# Altium schematic sheet Sheet1.SchDoc
size A
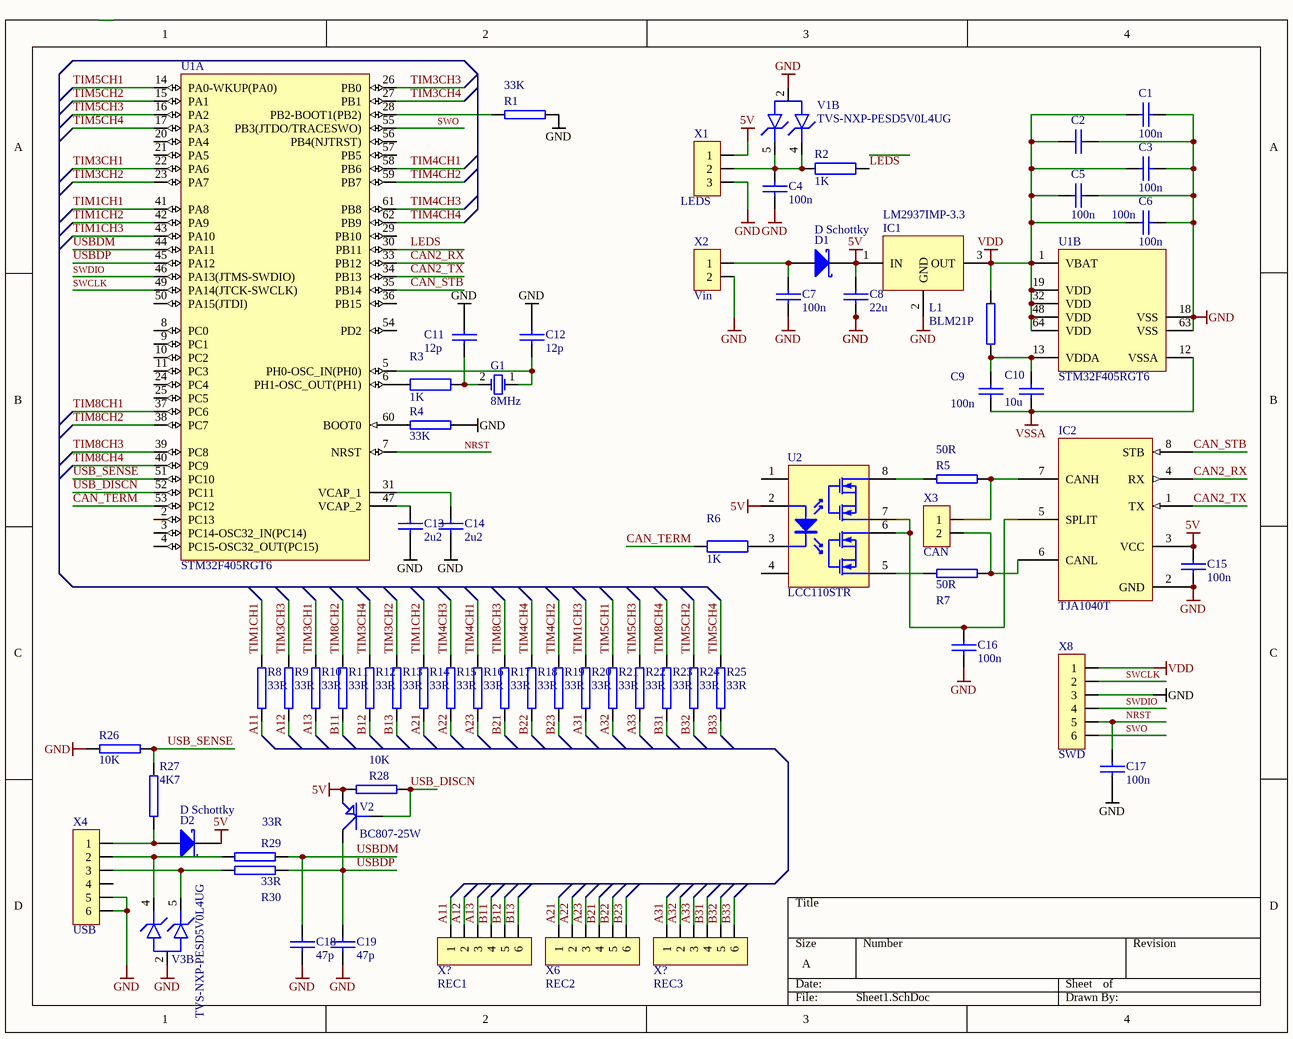
[diagram p0: Sheet1.SchDoc]

## Parts
(Parts that share a designator on the sheet are numbered #1, #2 ... from top to bottom, then left to right.)
C1  100n  [0805-C-IPC-V]
C2  100n  [0805-C-IPC-V]
C3  100n  [0805-C-IPC-V]
C4  100n  [0805-C-IPC-V]
C5  100n  [0805-C-IPC-V]
C6  100n  [0805-C-IPC-V]
C7  100n  [0805-C-IPC-V]
C8  22u  [CAPC3225N]
C9  100n  [0805-C-IPC-V]
C10  10u  [0805-C-IPC-V]
C11  12p  [0805-C-IPC-V]
C12  12p  [0805-C-IPC-V]
C13  2u2  [0805-C-IPC-V]
C14  2u2  [0805-C-IPC-V]
C15  100n  [0805-C-IPC-V]
C16  100n  [0805-C-IPC-V]
C17  100n  [0805-C-IPC-V]
C18  47p  [0805-C-V]
C19  47p  [0805-C-V]
D1  D Schottky  [SMB]
D2  D Schottky  [SMB]
G1  8MHz  [JXG53P2]
IC1  LM2937IMP-3.3  [SOT223-4N-V]
IC2  TJA1040T  [SO_8]
L1  BLM21P  [INDC2012N]
R1  33K  [0805-R-IPC-V]
R2  1K  [0805-R-IPC-V]
R3  1K  [0805-R-IPC-V]
R4  33K  [0805-R-IPC-V]
R5  50R  [0805-R-IPC-V]
R6  1K  [0805-R-IPC-V]
R7  50R  [0805-R-IPC-V]
R8  33R  [0805-R-IPC-V]
R9  33R  [0805-R-IPC-V]
R10  33R  [0805-R-IPC-V]
R11  33R  [0805-R-IPC-V]
R12  33R  [0805-R-IPC-V]
R13  33R  [0805-R-IPC-V]
R14  33R  [0805-R-IPC-V]
R15  33R  [0805-R-IPC-V]
R16  33R  [0805-R-IPC-V]
R17  33R  [0805-R-IPC-V]
R18  33R  [0805-R-IPC-V]
R19  33R  [0805-R-IPC-V]
R20  33R  [0805-R-IPC-V]
R21  33R  [0805-R-IPC-V]
R22  33R  [0805-R-IPC-V]
R23  33R  [0805-R-IPC-V]
R24  33R  [0805-R-IPC-V]
R25  33R  [0805-R-IPC-V]
R26  10K  [0805-R-IPC-V]
R27  4K7  [0805-R-IPC-V]
R28  10K  [0805-R-IPC-V]
R29  33R  [0805-R-IPC-V]
R30  33R  [0805-R-IPC-V]
U1  STM32F405RGT6  [STM-LQFP64_N]  (parts A,B of 2)
U2  LCC110STR  [IXYS-SM-8_V]
V1  TVS-NXP-PESD5V0L4UG  [SC70-5]  (part B of 2)
V2  BC807-25W  [SOT323-3N-CBE]
V3  TVS-NXP-PESD5V0L4UG  [SC70-5]  (part B of 2)
X1  LEDS  [CON-PH_3PIN_JST]
X2  Vin  [CON-PH_2PIN_JST]
X3  CAN  [CON-PH_2PIN_JST]
X4  USB  [CON_uUSB_TOP]
X6  REC2  [CON-06-MALE-TH-2MM-VERTICAL]
X8  SWD  [CON-06-MALE-TH-2MM-VERTICAL]
X?#1  REC1  [CON-06-MALE-TH-2MM-VERTICAL]
X?#2  REC3  [CON-06-MALE-TH-2MM-VERTICAL]

## Nets
5V: C8.2 C15.2 D1.2(K) D2.2(K) IC1.1(IN) IC2.3(VCC) R28.2 U2.2(CTRL+) V2.E X1.1
GND: C1.2 C2.2 C3.2 C4.2 C5.2 C6.2 C7.2 C8.1 C11.2 C12.1 C13.1 C14.1 C15.1 C16.1 C17.1 C18.1 C19.2 IC1.2(GND) IC2.2(GND) R1.1 R4.1 R26.2 U1.18(VSS) U1.63(VSS) V1.2 V3.2 X1.3 X2.2 X4.5 X4.6 X8.3
VDD: C1.1 C2.1 C3.1 C5.1 C6.1 IC1.3(OUT) L1.2 U1.1(VBAT) U1.19(VDD) U1.32(VDD) U1.48(VDD) U1.64(VDD) X8.1
VSSA: C9.2 C10.2 U1.12(VSSA)
A11: R8.1 X?#1.1
A12: R9.1 X?#1.2
A13: R10.1 X?#1.3
A21: R14.1 X6.1
A22: R15.1 X6.2
A23: R16.1 X6.3
A31: R20.1 X?#2.1
A32: R21.1 X?#2.2
A33: R22.1 X?#2.3
B11: R11.1 X?#1.4
B12: R12.1 X?#1.5
B13: R13.1 X?#1.6
B21: R17.1 X6.4
B22: R18.1 X6.5
B23: R19.1 X6.6
B31: R23.1 X?#2.4
B32: R24.1 X?#2.5
B33: R25.1 X?#2.6
CAN2_RX: IC2.4(RX) U1.33(PB12)
CAN2_TX: IC2.1(TX) U1.34(PB13)
CAN_STB: IC2.8(STB) U1.35(PB14)
CAN_TERM: R6.2 U1.53(PC12)
LEDS: R2.1 U1.30(PB11)
NRST: C17.2 U1.7(NRST) X8.5
SWCLK: U1.49(PA14(JTCK-SWCLK)) X8.2
SWDIO: U1.46(PA13(JTMS-SWDIO)) X8.4
SWO: U1.55(PB3(JTDO/TRACESWO)) X8.6
TIM1CH1: R8.2 U1.41(PA8)
TIM1CH2: R14.2 U1.42(PA9)
TIM1CH3: R20.2 U1.43(PA10)
TIM3CH1: R10.2 U1.22(PA6)
TIM3CH2: R13.2 U1.23(PA7)
TIM3CH3: R9.2 U1.26(PB0)
TIM3CH4: R12.2 U1.27(PB1)
TIM4CH1: R16.2 U1.58(PB6)
TIM4CH2: R19.2 U1.59(PB7)
TIM4CH3: R15.2 U1.61(PB8)
TIM4CH4: R18.2 U1.62(PB9)
TIM5CH1: R21.2 U1.14(PA0-WKUP(PA0))
TIM5CH2: R24.2 U1.15(PA1)
TIM5CH3: R22.2 U1.16(PA2)
TIM5CH4: R25.2 U1.17(PA3)
TIM8CH1: U1.37(PC6)
TIM8CH2: R11.2 U1.38(PC7)
TIM8CH3: R17.2 U1.39(PC8)
TIM8CH4: R23.2 U1.40(PC9)
USB_DISCN: R28.1 U1.52(PC11) V2.B
USB_SENSE: R26.1 R27.1 U1.51(PC10)
USBDM: C18.2 R29.2 U1.44(PA11)
USBDP: C19.1 R30.2 U1.45(PA12) V2.C
NetC4_1: C4.1 R2.2 V1.4 V1.5 X1.2
NetC7_1: C7.1 D1.1(A) X2.1
NetC9_1: C9.1 C10.1 L1.1 U1.13(VDDA)
NetC11_1: C11.1 G1.2(OSC2) R3.1
NetC12_2: C12.2 G1.1(OSC1) U1.5(PH0-OSC_IN(PH0))
NetC13_2: C13.2 U1.47(VCAP_2)
NetC14_2: C14.2 U1.31(VCAP_1)
NetC16_2: C16.2 IC2.5(SPLIT) U2.6(NO) U2.7(NC)
NetD2_1: D2.1(A) R27.2 X4.1
NetIC2_6: IC2.6(CANL) R7.1 X3.2
NetIC2_7: IC2.7(CANH) R5.1 X3.1
NetR1_2: R1.2 U1.28(PB2-BOOT1(PB2))
NetR3_2: R3.2 U1.6(PH1-OSC_OUT(PH1))
NetR4_2: R4.2 U1.60(BOOT0)
NetR5_2: R5.2 U2.8(NC)
NetR6_1: R6.1 U2.3(CTRL-)
NetR7_2: R7.2 U2.5(NO)
NetR29_1: R29.1 V3.4 X4.2
NetR30_1: R30.1 V3.5 X4.3

Not connected (* = marked no-connect by the designer): U1 2(PC13) 3(PC14-OSC32_IN(PC14)) 4(PC15-OSC32_OUT(PC15)) 8(PC0) 9(PC1) 10(PC2) 11(PC3) 20(PA4) 21(PA5) 24(PC4) 25(PC5) 29(PB10) 36(PB15) 50(PA15(JTDI)) 54(PD2) 56(PB4(NJTRST)) 57(PB5); U2 1(DNU) 4(DNU); X4 4

## Library data of the parts
C1-C7 C9 C15 C16 = C: KOND. 0805 100nF 50V 10% X7R; 3. Dodatni opis: SMD 0805 X7R 10% 100V; 9.a FOTONA ID:: 59327; Mi Elektronika ID: 006076; 1. Naziv: KOND.; 8. Oblika: SMD 0805; 2. Vrednost: 100n
C8 = 22u 1210 X7R 25V 10%: KOND. 1210 22uF 25V 10% X5R; 4. Proizvajalec: MURATA; 6. Dobavitelj: Farnell; 7. Dobavitelj koda: 1828821; 5. Proizvajalec koda: GRM32ER61E226KE15L; 3. Dodatni opis: SMD 1210 X5R 10% 25V; 1. Naziv: KOND.; 8. Oblika: SMD 1210; 2. Vrednost: 22u
C10 = 10u 0603 X5R 6V3 10%: KOND. 0805 10uF 10V 10% X7R; 4. Proizvajalec: TDK; 6. Dobavitelj: Farnell; 7. Dobavitelj koda: 2346934; 5. Proizvajalec koda: C2012X7R1A106K125AC; 3. Dodatni opis: SMD 0805 X7R 10% 10V; 9.a FOTONA ID:: 76490; 1. Naziv: KOND.; 8. Oblika: SMD 0805; 2. Vrednost: 10u
C11 C12 = 12p 0603 C0G 50V 10%: KOND. 0805 12pF 50V 5% COG; 3. Dodatni opis: SMD 0805 COG 5% 50V; 1. Naziv: KOND.; 8. Oblika: SMD 0805; 2. Vrednost: 12p
C13 C14 = 2u2 0603 X5R 16V 10%: KOND. 0805 2,2uF 25V 10% X7R; 4. Proizvajalec: MURATA; 6. Dobavitelj: Farnell; 7. Dobavitelj koda: 2688538; 5. Proizvajalec koda: GRM21BR71E225KE11L; 3. Dodatni opis: SMD 0805 X7R 10% 25V; 1. Naziv: KOND.; 8. Oblika: SMD 0805; 2. Vrednost: 2u2
C17 = 100n 0603 X7R 50V 10%: KOND. 0805 100nF 50V 10% X7R; 3. Dodatni opis: SMD 0805 X7R 10% 100V; 9.a FOTONA ID:: 59327; Mi Elektronika ID: 006076; 1. Naziv: KOND.; 8. Oblika: SMD 0805; 2. Vrednost: 100n
C18 C19 = C: KOND. 0805 47pF 50V 5% COG; 3. Dodatni opis: SMD 0805 COG 5% 50V; 9.a FOTONA ID:: 39615; 1. Naziv: KOND.; 8. Oblika: SMD 0805; 2. Vrednost: 47p
D1 D2 = D Schottky: Schottky Diode; Published: 8-Jun-2000; LatestRevisionDate: 17-Jul-2002; LatestRevisionNote: Re-released for DXP Platform.; PackageReference: SMB; Publisher: Altium Limited; PackageDescription: DO-214-AA/SMB; 2 C-Bend Leads; Body 5.3 x 3.6 mm, inc. leads (LxW); Code_JEDEC: DO-214-AA
G1 = Crystal 25MHz: Crystal, 8 MHz, SMD, 5mm x 3.2mm; 8. Oblika: SMD 5x3.2mm; 6. Dobavitelj: Farnell; 7. Dobavitelj koda: 2101329RL; 1. Naziv: KRISTAL; 4. Proizvajalec: ABRACON; 5. Proizvajalec koda: ABM3-8.000MHZ-D2Y-T; 2. Vrednost: 8MHz
IC1 = LM2937IMP-3.3: Fixed 3V3 Regulator; 1. Naziv: VEZJE INT.; 8. Oblika: SMD SOT-232-3N; 4. Proizvajalec: TEXAS INSTRUMENTS; 6. Dobavitelj: Farnell; 7. Dobavitelj koda: 2296021; 5. Proizvajalec koda: LM2937IMP-3.3/NOPB; 9.a FOTONA ID:: 87573; 2. Vrednost: LM2937IMP-3.3
IC2 = TJA1040: CAN Bus, Transceiver; 1. Naziv: VEZJE INT.; 8. Oblika: SMD SO-8; 4. Proizvajalec: NXP; 6. Dobavitelj: Farnell; 7. Dobavitelj koda: 2400545; 5. Proizvajalec koda: TJA1040T/CM,118; 9.a FOTONA ID:: 80870; 2. Vrednost: TJA1040T
L1 = BLM21: Ferrite Bead, 0805; 1. Naziv: DUŠILKA; 4. Proizvajalec: MURATA; 6. Dobavitelj: Farnell; 7. Dobavitelj koda: 1515663; 5. Proizvajalec koda: BLM21PG331SN1D; 9.a FOTONA ID:: 90218; 8. Oblika: SMD 0805; 2. Vrednost: BLM21PG331SN1D
R1 R4 = R: UPOR 0805 33K 1% 0,125W; 3. Dodatni opis: SMD 0805 1% 150V; 9.a FOTONA ID:: 57352; Mi Elektronika ID: 002109; 1. Naziv: UPOR; 8. Oblika: SMD 0805; 2. Vrednost: 33K
R2 R3 R6 = 1k 1% 0603 0.1W 50V: UPOR 0805 1K 1% 0,125W; 3. Dodatni opis: SMD 0805 1% 150V; 9.a FOTONA ID:: 57346; 1. Naziv: UPOR; 8. Oblika: SMD 0805; 2. Vrednost: 1K
R5 R7 = R: UPOR 0805 62R 1% 0,125W; 3. Dodatni opis: SMD 0805 1% 150V; 1. Naziv: UPOR; 8. Oblika: SMD 0805; 2. Vrednost: 50R
R8-R25 R29 R30 = R: UPOR 0805 33R 1% 0,125W; 3. Dodatni opis: SMD 0805 1% 150V; Mi Elektronika ID: 002153; 1. Naziv: UPOR; 8. Oblika: SMD 0805; 2. Vrednost: 33R
R26 R28 = R: UPOR 0805 10K 1% 0,125W; 3. Dodatni opis: SMD 0805 1% 150V; 9.a FOTONA ID:: 57338; Mi Elektronika ID: 002470; 1. Naziv: UPOR; 8. Oblika: SMD 0805; 2. Vrednost: 10K
R27 = R: UPOR 0805 4,7K 1% 0,125W; 3. Dodatni opis: SMD 0805 1% 150V; 9.a FOTONA ID:: 57341; 1. Naziv: UPOR; 8. Oblika: SMD 0805; 2. Vrednost: 4K7
U1 = STM32F405RGT6: ARM Cortex-M4 32-bit MCU+FPU, 210 DMIPS, 1024 kB Flash, 192 kB Internal RAM, 51 I/Os, 64-pin LQFP, -40 to 85 degC, Tray; Manufacturer: STMicroelectronics; D/A Converter: 2x12-bit; FLASH Size (Prog) (kB): 1024; I/Os (High Current): 51; Internal RAM Size (kB): 192; Operating Frequency(F) (Processor speed) (MHz): 168; Supply Voltage(Vcc) max (V): 3.6; Supply Voltage(Vcc) min (V): 1.8; DatasheetVersion: Rev. 4; PackageVersion: Rev. 4, 06/2013; PackageReference: LQFP64; PackageDescription: 64-Pin Low Profile Quad Flat Package, 10 x 10 mm Body, 0.5 mm Pitch; Supplier 1: Digi-Key; Supplier Part Number 1: 497-11767-ND; Supplier 2: Farnell; Supplier Part Number 2: 2064363; Supplier 3: Newark; Supplier Part Number 3: 73T2329; Supplier 4: Mouser; Supplier Part Number 4: 511-STM32F405RGT6; Core: ARM Cortex-M4; Packing: Tray; Mounting Technology: Surface Mount; PartNumber: STM32F405RGT6; ComponentLink1Description: Manufacturer URL; ComponentLink1URL: http://www.st.com/web/en/home.html; ComponentLink2Description: Datasheet; ComponentLink2URL: http://www.st.com/st-web-ui/static/active/en/resource/technical/document/datasheet/DM00037051.pdf; ComponentLink3Description: Package Specification; ComponentLink3URL: http://www.st.com/st-web-ui/static/active/en/resource/technical/document/datasheet/DM00037051.pdf
U2 = CMP-2000-06537-1: 1-Form-C OptoMOS(R) Relay / , 350 V, 120 mA, 35 Ohm, -40 to 85 degC, 8-Pin SMD, RoHS, Tape and Reel; Manufacturer: IXYS; Contact Form: SPDT(1FormC); Load Current Rating: 120mA; Output Type: MOSFET; Input Current: 50mA; Brand: IXYSIntegratedCircuits; Pd - Power Dissipation: 800mW; Input to Output Isolation Method: Optocoupler; Load Voltage Rating: 350VDC; Control Voltage Range: 0.9VDCto1.4VDC; Series: LCC110; Tradename: Clare; Factory Pack Quantity: 1000; Datasheet URL: http://www.ixysic.com/home/pdfs.nsf/www/LCC110.pdf/$file/LCC110.pdf; Mounting Style: SMD/SMT; Package Description: 8-Pin Surface Mount Device, Body 9.652 x 6.35 mm, Pitch 2.54 mm; Product Category: SolidStateRelays-PCBMount; Width: 6.35mm; Mounting Technology: SurfaceMount; Manufacturer URL: http://www.ixys.com/; Package / Case: SMDDIP-8; Datasheet Version: 12/2012; Height: 3.302mm; Type: Isolated; Termination Style: GullWingLead; Length: 9.652mm; Product: TelecommunicationRelays; Package Reference: SM-8; Packaging: Reel
V1 V3 = TVS-NXP-PESD3V3L4UG: TVS, NXP, PESD3V3L4UG, SOT665; 8. Oblika: SMD SC70-5; 6. Dobavitelj: Farnell; 7. Dobavitelj koda: 8737614; 1. Naziv: TVS; 4. Proizvajalec: NXP; 5. Proizvajalec koda: PESD5V0L4UG; 2. Vrednost: TVS-NXP-PESD5V0L4UG; 3. Dodatni opis: PESD5V0L4UG
V2 = BC807W: PNP Bipolar Transistor; 1. Naziv: TRANZISTOR; 8. Oblika: SMD SOT-323-3N; 4. Proizvajalec: NXP; 6. Dobavitelj: Farnell; 7. Dobavitelj koda: 2439008; 5. Proizvajalec koda: BC807-25W,115; 9.a FOTONA ID:: 97206; 2. Vrednost: BC807-25W
X1 = CON3: 1. Naziv: KONEKTOR; 4. Proizvajalec: JST; 6. Dobavitelj: Farnell; 7. Dobavitelj koda: 9492429; 5. Proizvajalec koda: B3B-PH-K-S(LF)(SN); 9.a FOTONA ID:: 90115; 2. Vrednost: LEDS
X2 X3 = JST S2B-ZR-SM4A-TF: Connector, 2 mm, 2 Contacts; 1. Naziv: KONEKTOR; 4. Proizvajalec: JST; 6. Dobavitelj: Farnell; 7. Dobavitelj koda: 9491856; 5. Proizvajalec koda: B2B-PH-K-S(LF)(SN); 9.a FOTONA ID:: 89540
  X2: 2. Vrednost: Vin
  X3: 2. Vrednost: CAN
X4 = Wurth 629 105 136 821: Connector, Micro USB Type B; 1. Naziv: KONEKTOR; 4. Proizvajalec: GCT; 6. Dobavitelj: Farnell; 7. Dobavitelj koda: 2443141; 5. Proizvajalec koda: USB3145-30-1-A; 2. Vrednost: USB
X6 X8 X?#1 X?#2 = 100mil Header 1x6: Connector, 2 mm, 6 Contacts; 4. Proizvajalec: AMPHENOL; 5. Proizvajalec koda: 10075025-G01-06LF; 6. Dobavitelj: Farnell; 7. Dobavitelj koda: 1568594